# EAGLE design EMP5 (EAGLE 6.6.0)
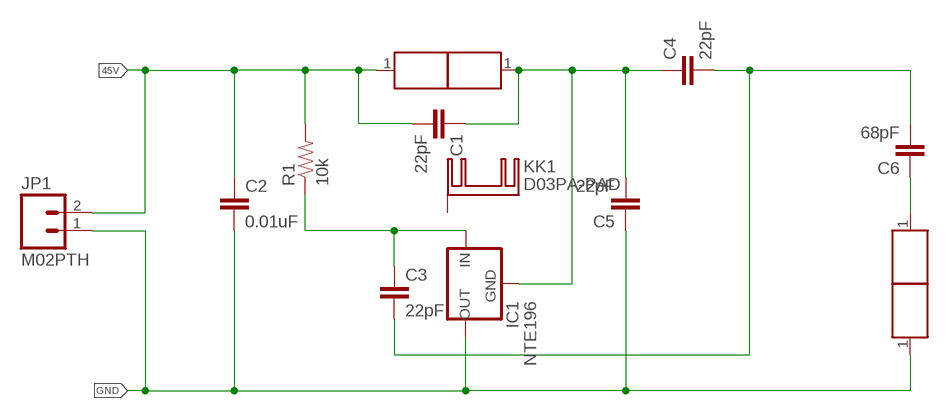
[diagram p0: schematic, sheet 1]

## Parts
C1  22pF  CAPKIT  [CAP-PTH-SMALL-KIT]
C2  0.01uF  CAPKIT  [CAP-PTH-SMALL-KIT]
C3  22pF  CAPKIT  [CAP-PTH-SMALL-KIT]
C4  22pF  CAPKIT  [CAP-PTH-SMALL-KIT]
C5  22pF  CAPKIT  [CAP-PTH-SMALL-KIT]
C6  68pF  CAPKIT  [CAP-PTH-SMALL-KIT]
IC1  NTE196  V_REG_78XXSINK  [TO220-IGO]
JP1  M02PTH  [1X02]
KK1  D03PA-PAD  [D03PA-PAD]
L1-1  L2_JOB37  [L2_JOB37]
L1-2  L2_JOB37  [L2_JOB37]
L2-1  L2_JOB37  [L2_JOB37]
L2-2  L2_JOB37  [L2_JOB37]
R1  10k  RESISTOREZ  [AXIAL-0.3EZ]

## Nets
45V: C1.2 C2.1 JP1.2 L1-1.1 R1.P$2
GND: C2.2 C5.1 IC1.OUT JP1.1 L2-2.1
N$1: C3.1 IC1.IN R1.P$1
N$2: C1.1 C4.1 C5.2 IC1.GND L1-2.1
N$8: C6.1 L2-1.1
N$10: C3.2 C4.2 C6.2
Unconnected: KK1.B(K)

## Library data of the parts
C1-C6 = SparkFun-Capacitors:CAP: Capacitor Standard 0603 ceramic capacitor, and 0.1" leaded capacitor.
IC1 = SparkFun-PowerIC:V_REG_78XX: Voltage Regulator Standard 7805 5V regulator. IGO (Input Ground Output). Spark Fun Electronics SKU : COM-00107
JP1 = SparkFun-Connectors:M02: Standard 2-pin 0.1" header. Use with - straight break away headers ( PRT-00116) - right angle break away headers (PRT-00553) - swiss pins (PRT-00743) - machine pins (PRT-00117) - female headers (PRT-00115) Molex polarized connector foot print use with: PRT-08233 with associated crimp pins and housings. 2.54_SCREWTERM for use with PRT-10571. 3.5mm Screw Terminal footprints for PRT-08084 5mm Screw Terminal footprints for use with PRT-08433
KK1 = heatsink:D03PA-PAD: HEATSINK distributor Schukat
L1-1 L1-2 L2-1 L2-2 = L2:L2_JOB37
R1 = SparkFun-Resistors:RESISTOR: Resistor Basic schematic elements and footprints for 0603, 1206, and PTH resistors.

## Board
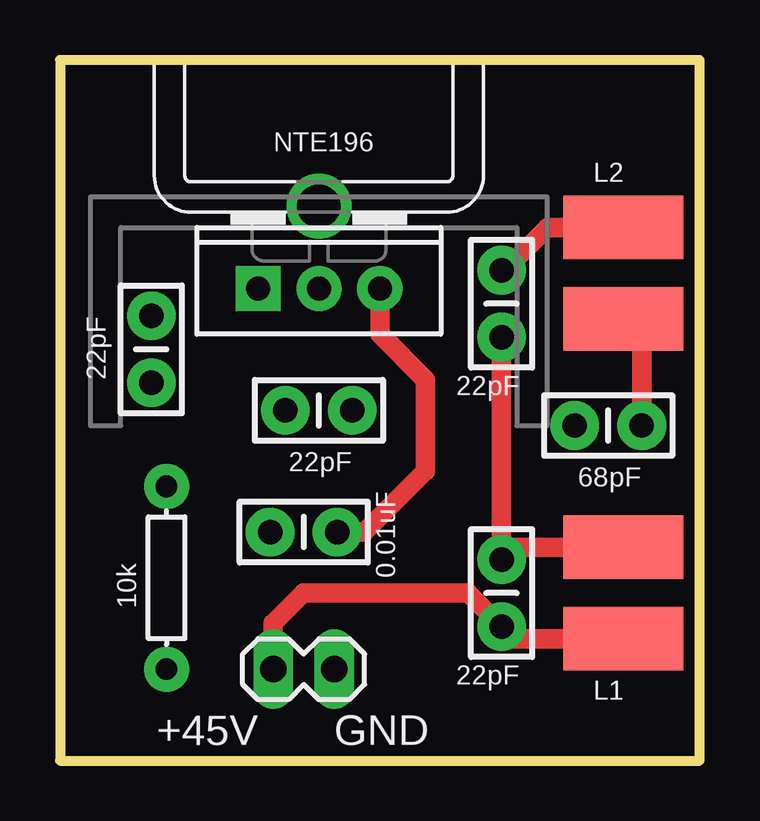
[diagram p1: board, top side]
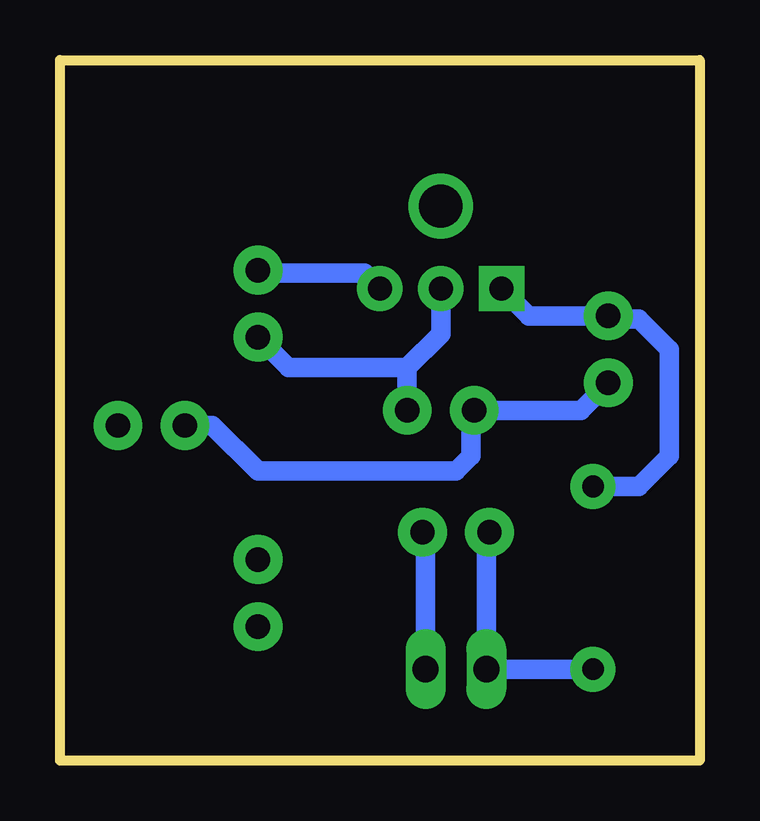
[diagram p2: board, bottom side, seen from below]

Size 26.67 x 29.21 mm. Coordinates in mm from the lower left corner, seen from the top.
Outline: 0,0 26.67,0 26.67,29.21 0,29.21 0,0
Copper layers (1*16): Top 0.035mm / dielectric 1.5mm / Bottom 0.035mm
Design rules "default": minimum track width 10mil, minimum drill 24mil, track to track 8mil, track to pad 8mil, pad to pad 8mil, via to via 8mil, smd to smd 8mil, copper to edge 40mil, drill to drill 8mil, minimum pad ring 10mil, minimum via ring 8mil, stop-mask expansion 4mil, vias tented up to drill 0mil, thermal gap 10mil

### Footprints (pad centres in the part's own frame; a part is rotated, then mirrored left to right if it is on the bottom)
CAP-PTH-SMALL-KIT = drill 1.016 pad 2.032: 1 -1.397,0; 2 1.397,0
TO220-IGO = drill 1 pad 1.88: GND 0,0; OUT 2.54,0 | drill 1 pad 1.88 square: IN -2.54,0
1X02 = drill 1.1 pad 1.676 long: 1 0,0; 2 2.54,0
D03PA-PAD = drill 1.803 pad 2.54: B 0,-1.016
L2_JOB37 = smd 2.65 x 5: 1 0,0
AXIAL-0.3EZ = drill 0.9 pad 1.88: P$1 -3.81,0; P$2 3.81,0

### Placement (x,y rotation side)
C1  18.41,6.99 270 top
C2  10.16,9.53 0 top
C3  3.81,17.14 270 top
C4  10.79,14.61 180 top
C5  18.41,19.05 270 top
C6  22.86,13.97 180 top
IC1  10.79,19.68 0 top
JP1  11.43,3.81 180 top
KK1  10.79,24.13 0 top
L1-1  23.5,5.08 90 top
L1-2  23.5,8.89 90 top
L2-1  23.5,18.41 270 top
L2-2  23.5,22.23 270 top
R1  4.45,7.62 270 top

### Tracks (layer width: path | path; a pad name or v marks a point on that pad's centre or on a via)
45V
  Top 0.813: L1-1.1 18.92,5.08 C1.2 17.02,6.99 10.16,6.99 8.89,5.71 JP1.2
  Bottom 0.813: C2.1 8.89,9.53 JP1.2 R1.P$2
GND
  Top 0.813: L2-2.1 20.32,22.23 18.54,20.45 C5.1 | IC1.OUT 13.34,17.78 15.24,15.88 15.24,12.06 12.7,9.53 C2.2
  Bottom 0.813: C2.2 11.43,9.53 JP1.1 | C5.1 18.29,20.32 13.97,20.32 IC1.OUT
N$1
  Bottom 0.813: R1.P$1 2.54,11.43 1.27,12.7 1.27,17.14 2.54,18.41 3.68,18.41 C3.1 7.11,18.54 IC1.IN
N$2
  Top 0.813: L1-2.1 18.92,8.89 C1.1 C5.2
  Bottom 0.813: IC1.GND 10.79,17.78 12.19,16.38 | 12.19,16.38 C4.1 | 12.19,16.38 17.14,16.38 C5.2
N$8
  Top 0.813: L2-1.1 24.26,17.65 C6.1
N$10
  Bottom 0.813: C3.2 4.95,14.61 C4.2 9.53,14.48 9.53,12.7 10.16,12.06 18.41,12.06 20.32,13.97 C6.2

### Text on the board
tPlace: NTE196 | L2 | 22pF | 22pF | 22pF | 68pF | 0.01uF | 10k | 22pF | L1 | +45V | GND